# EAGLE design charLED (EAGLE 9.1.0)
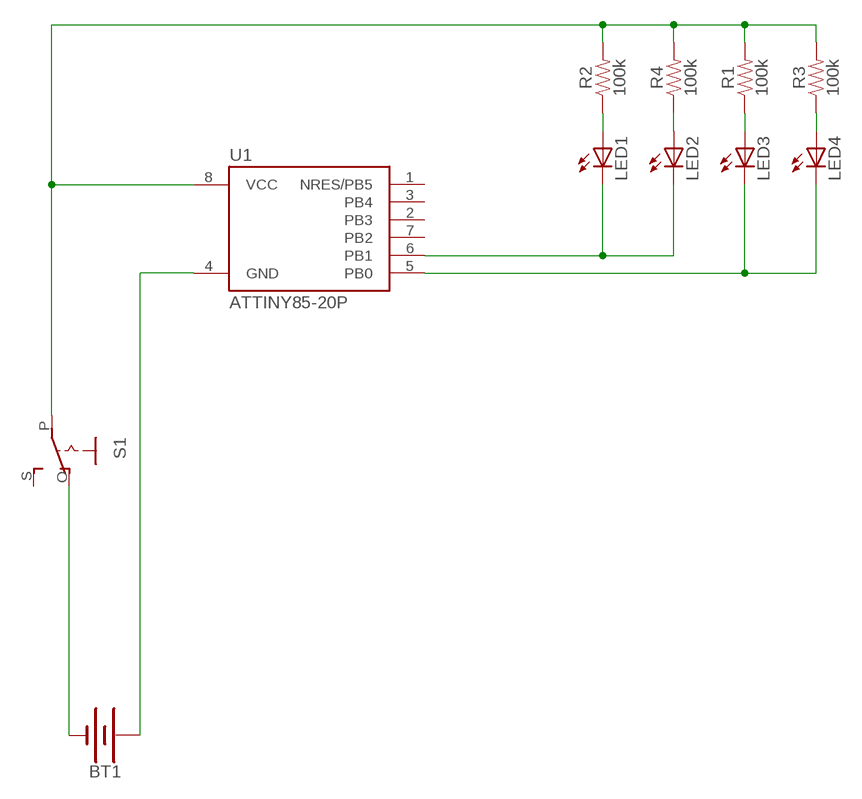
[diagram p0: schematic, sheet 1]

## Parts
BT1  BATTERY-20MM_PTH  [BATTCOM_20MM_PTH]
LED1  LED5MM  [LED5MM]
LED2  LED5MM  [LED5MM]
LED3  LED5MM  [LED5MM]
LED4  LED5MM  [LED5MM]
R1  100k  100KOHM-HORIZ-1/4W-1%  [AXIAL-0.3]
R2  100k  100KOHM-HORIZ-1/4W-1%  [AXIAL-0.3]
R3  100k  100KOHM-HORIZ-1/4W-1%  [AXIAL-0.3]
R4  100k  100KOHM-HORIZ-1/4W-1%  [AXIAL-0.3]
S1  EG1218S  [EG1218]
U1  ATTINY85-20P  [PDIP08_300MIL]

## Nets
N$1: LED1.K(C) LED2.K(C) U1.6(PB1)
N$2: LED1.A R2.P$1
N$3: BT1.2(-) S1.O
N$4: LED3.K(C) LED4.K(C) U1.5(PB0)
N$5: BT1.1(+) U1.4(GND)
N$6: R1.P$2 R2.P$2 R3.P$2 R4.P$2 S1.P U1.8(VCC)
N$7: LED2.A R4.P$1
N$8: LED4.A R3.P$1
N$9: LED3.A R1.P$1
Unconnected: S1.S U1.1(NRES/PB5) U1.2(PB3) U1.3(PB4) U1.7(PB2)

## Library data of the parts
BT1 = SparkFun-Batteries:BATTERY: Battery - Single Cell A variety of battery chemistries, sizes, and footprints. Device List: 20MM_PTH - Coin Cell Battery Holder - 20mm (PTH) <https://www.sparkfun.com/products/783> 6.8MM_PTH - Coin Cell Battery Holder - 6.8MM(SMD) <https://www.digikey.com/product-detail/en/seiko-instruments/MS621FE-FL11E/728-1057-ND/1889208?WT.srch=1&gclid=CNOQ5a6LzdQCFZS2wAodXCkE0g> 12MM_SMD - Coin Cell Battery Holder - 12mm (SMD) <https://www.sparkfun.com/products/10592> 12MM_PTH - Coin Cell Battery Holder - 12mm (PTH) <https://www.sparkfun.com/products/7948> 20MM_SMD - 20mm Coin Cell Battery Holder (SMD) (2 legs) Used on the Big Time Watch Kit <https://www.sparkfun.com/products/11734> 20MM_SMD_4LEGS - Coin Cell Battery Holder - 20mm (SMD) <https://www.sparkfun.com/products/11892> 20MM_SMD_4LEGS_OVERPASTE - Coin Cell Battery Holder - 20mm (SMD) <https://www.sparkfun.com/products/11892> (Over-paste on the legs) 24.5MM_PTH - Coin Cell Battery Holder - 24.5mm (PTH) <https://www.sparkfun.com/products/8863> 9V - 9V Battery Holder - PC Mount Used on the SparkFun SparkPunk Sound Kit <https://www.sparkfun.com/products/11177> and SparkFun SparkPunk Sequencer Kit <https://www.sparkfun.com/products/12707> 18650 - Battery Holder - 18650 (PTH) <https://www.sparkfun.com/products/13113> AA - Battery Holder - 1xAA (PTH) <https://www.sparkfun.com/products/7949> AAA - Battery Holder - 1xAAA (PTH) <https://www.sparkfun.com/products/12718> AA_KIT - Battery Holder - 1xAA (PTH) <https://www.sparkfun.com/products/7949> Special kit package - pads only have exposed copper on one side of the board. AAA_KIT - Battery Holder - 1xAAA (PTH) <https://www.sparkfun.com/products/12718> Special kit package - pads only have exposed copper on one side of the board.; PROD_ID: BATT-09031; SF_SKU: PRT-00783
LED1-LED4 = adafruit:LED: LED OSRAM: - CHIPLED LG R971, LG N971, LY N971, LG Q971, LY Q971, LO R971, LY R971 LH N974, LH R974 LS Q976, LO Q976, LY Q976 LO Q996 - Hyper CHIPLED LW Q18S LB Q993, LB Q99A, LB R99A - SideLED LS A670, LO A670, LY A670, LG A670, LP A670 LB A673, LV A673, LT A673, LW A673 LH A674 LY A675 LS A676, LA A676, LO A676, LY A676, LW A676 LS A679, LY A679, LG A679 - Hyper Micro SIDELED® LS Y876, LA Y876, LO Y876, LY Y876 LT Y87S - SmartLED LW L88C, LW L88S LB L89C, LB L89S, LG L890 LS L89K, LO L89K, LY L89K LS L896, LA L896, LO L896, LY L896 - TOPLED LS T670, LO T670, LY T670, LG T670, LP T670 LSG T670, LSP T670, LSY T670, LOP T670, LYG T670 LG T671, LOG T671, LSG T671 LB T673, LV T673, LT T673, LW T673 LH T674 LS T676, LA T676, LO T676, LY T676, LB T676, LH T676, LSB T676, LW T676 LB T67C, LV T67C, LT T67C, LS T67K, LO T67K, LY T67K, LW E67C LS E67B, LA E67B, LO E67B, LY E67B, LB E67C, LV E67C, LT E67C LW T67C LS T679, LY T679, LG T679 LS T770, LO T770, LY T770, LG T770, LP T770 LB T773, LV T773, LT T773, LW T773 LH T774 LS E675, LA E675, LY E675, LS T675 LS T776, LA T776, LO T776, LY T776, LB T776 LHGB T686 LT T68C, LB T68C - Hyper Mini TOPLED® LB M676 - Mini TOPLED Santana® LG M470 LS M47K, LO M47K, LY M47K Source: http://www.osram.convergy.de/
R1-R4 = SparkFun-Resistors:100KOHM: 100kΩ resistor A resistor is a passive two-terminal electrical component that implements electrical resistance as a circuit element. Resistors act to reduce current flow, and, at the same time, act to lower voltage levels within circuits. - Wikipedia; PROD_ID: RES-12184
S1 = adafruit:EG1218: SLIDING SWITCH 0.1" spacing through hole, vertical SPDT slide switch http://www.ladyada.net/library/pcb/eaglelibrary.html
U1 = _hhn_attiny25_45_85:ATTINY85*: ATMEL ATtiny 85 Packages: P = PDIP 08 30mil S = SOIC 08 EIAJ 208mil Technologies Note: for complete ordering code (temp. range, finish, tape&reel etc.) see www.atmel.com • Supply Voltage: V = (1.8…5.5)V | [blank] = (2.7…5.5)V • Speed: 10 = 10 MHz | 20 = 20 MHz Author: Dipl.-Ing. FH Rainer Bayer HHN Hochschule Heilbronn (Heilbronn University), rainer.bayer@hs-heilbronn.de Ingenieurbüro ing-rb, mail@ing-rb.de

## Board
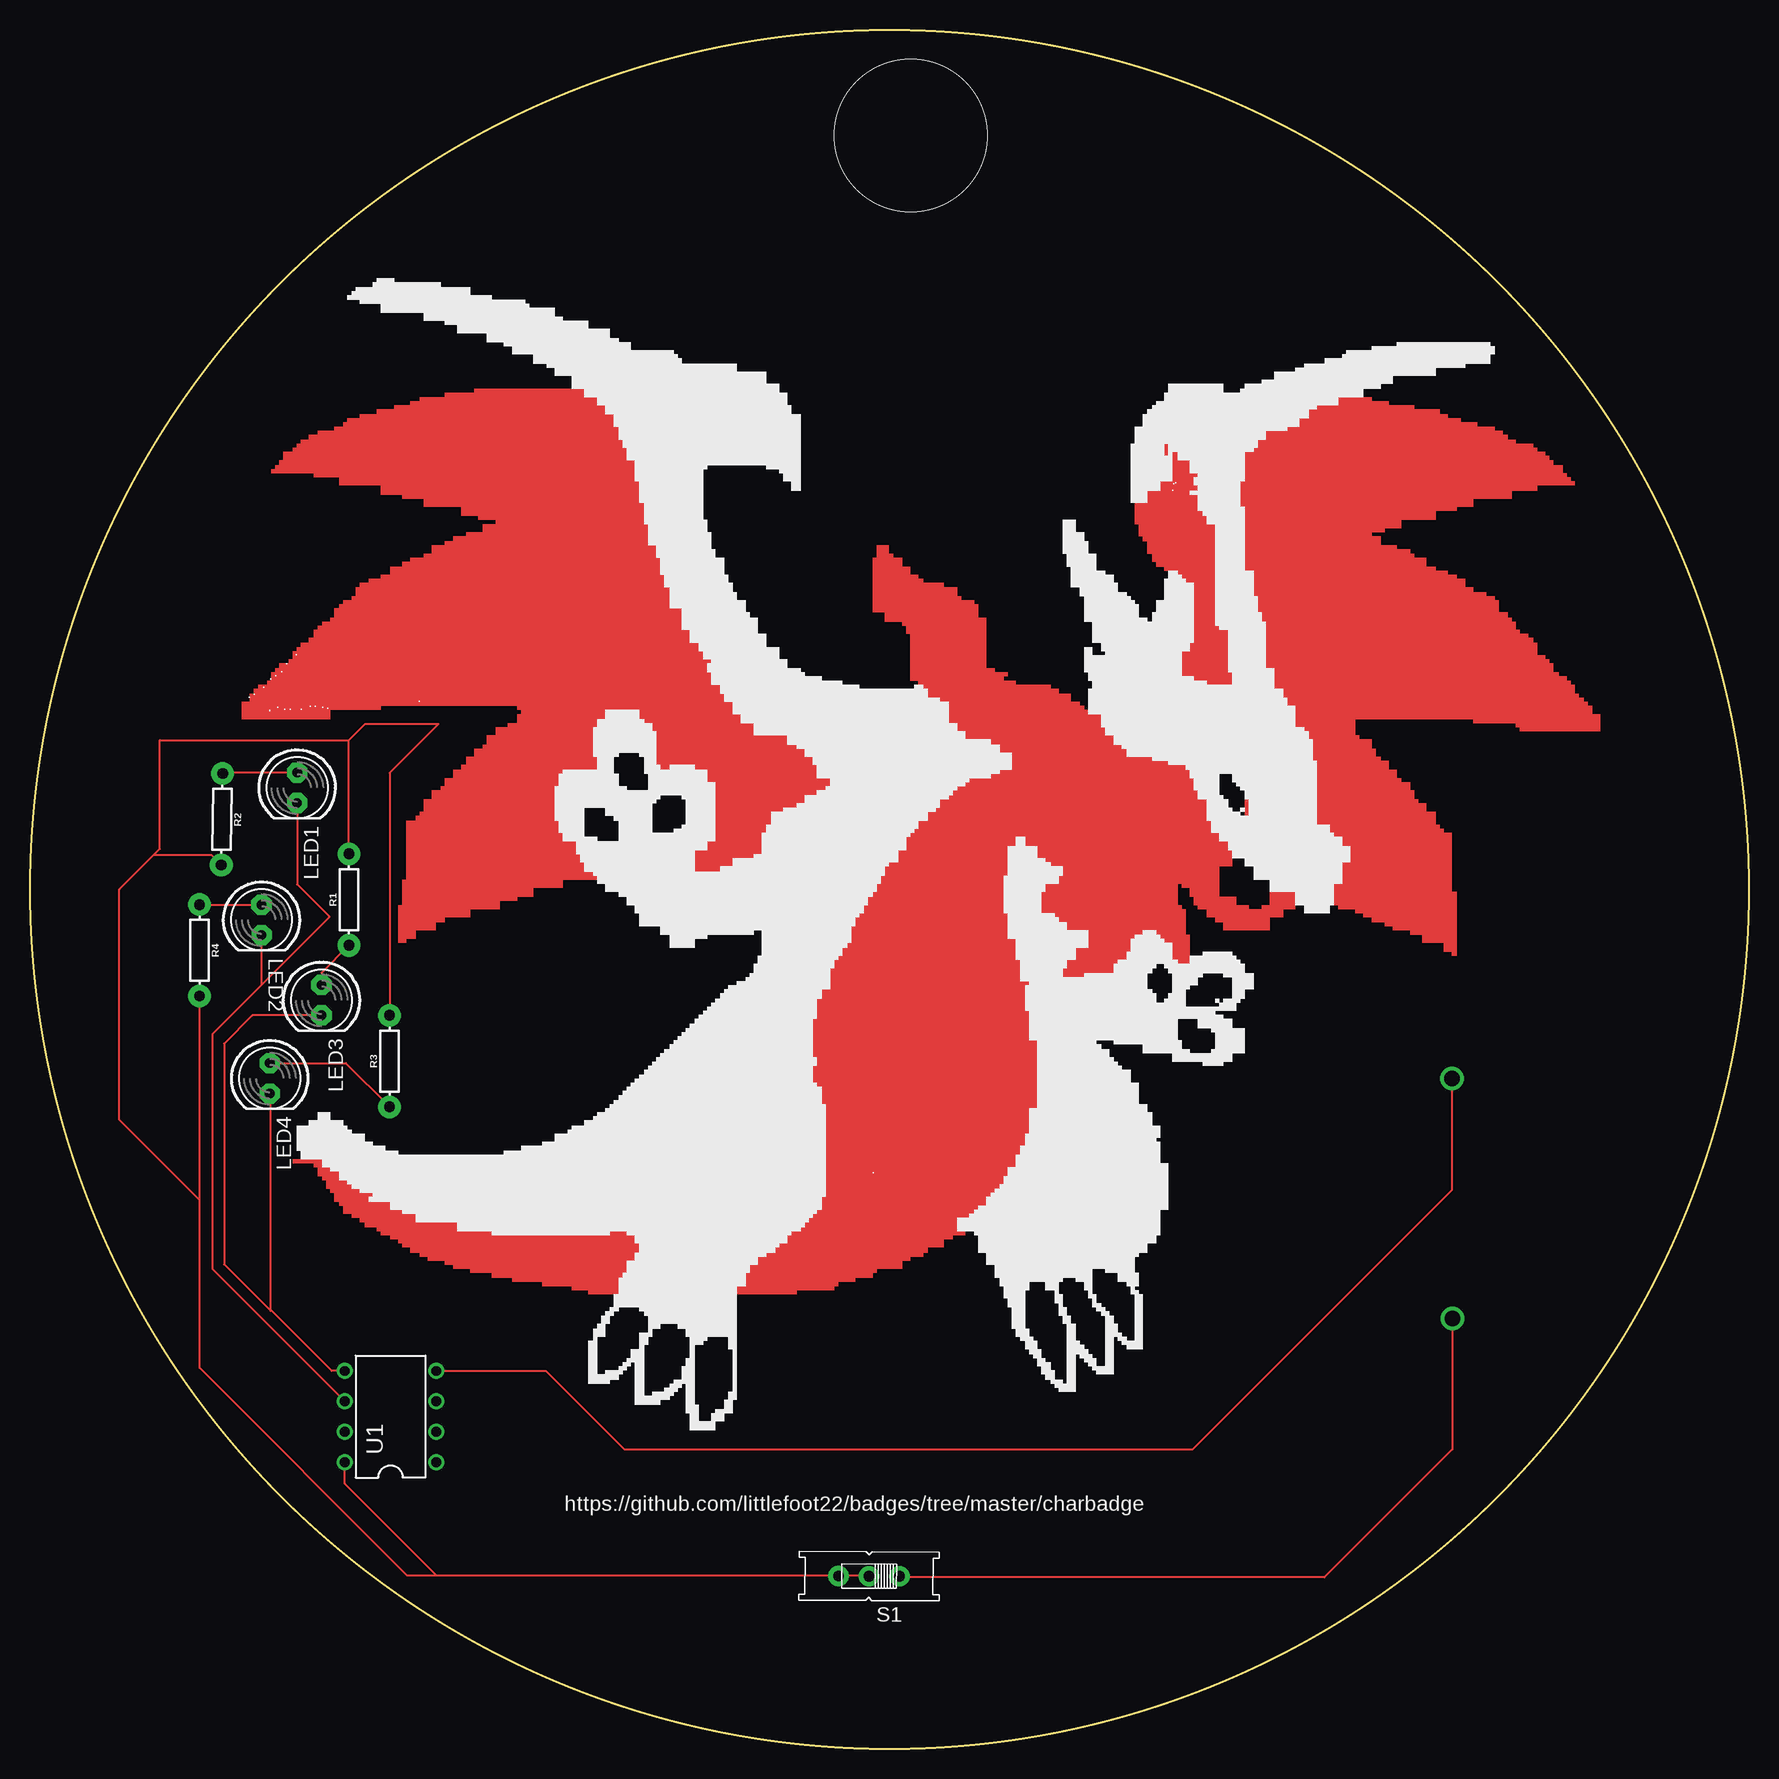
[diagram p1: board, top side]
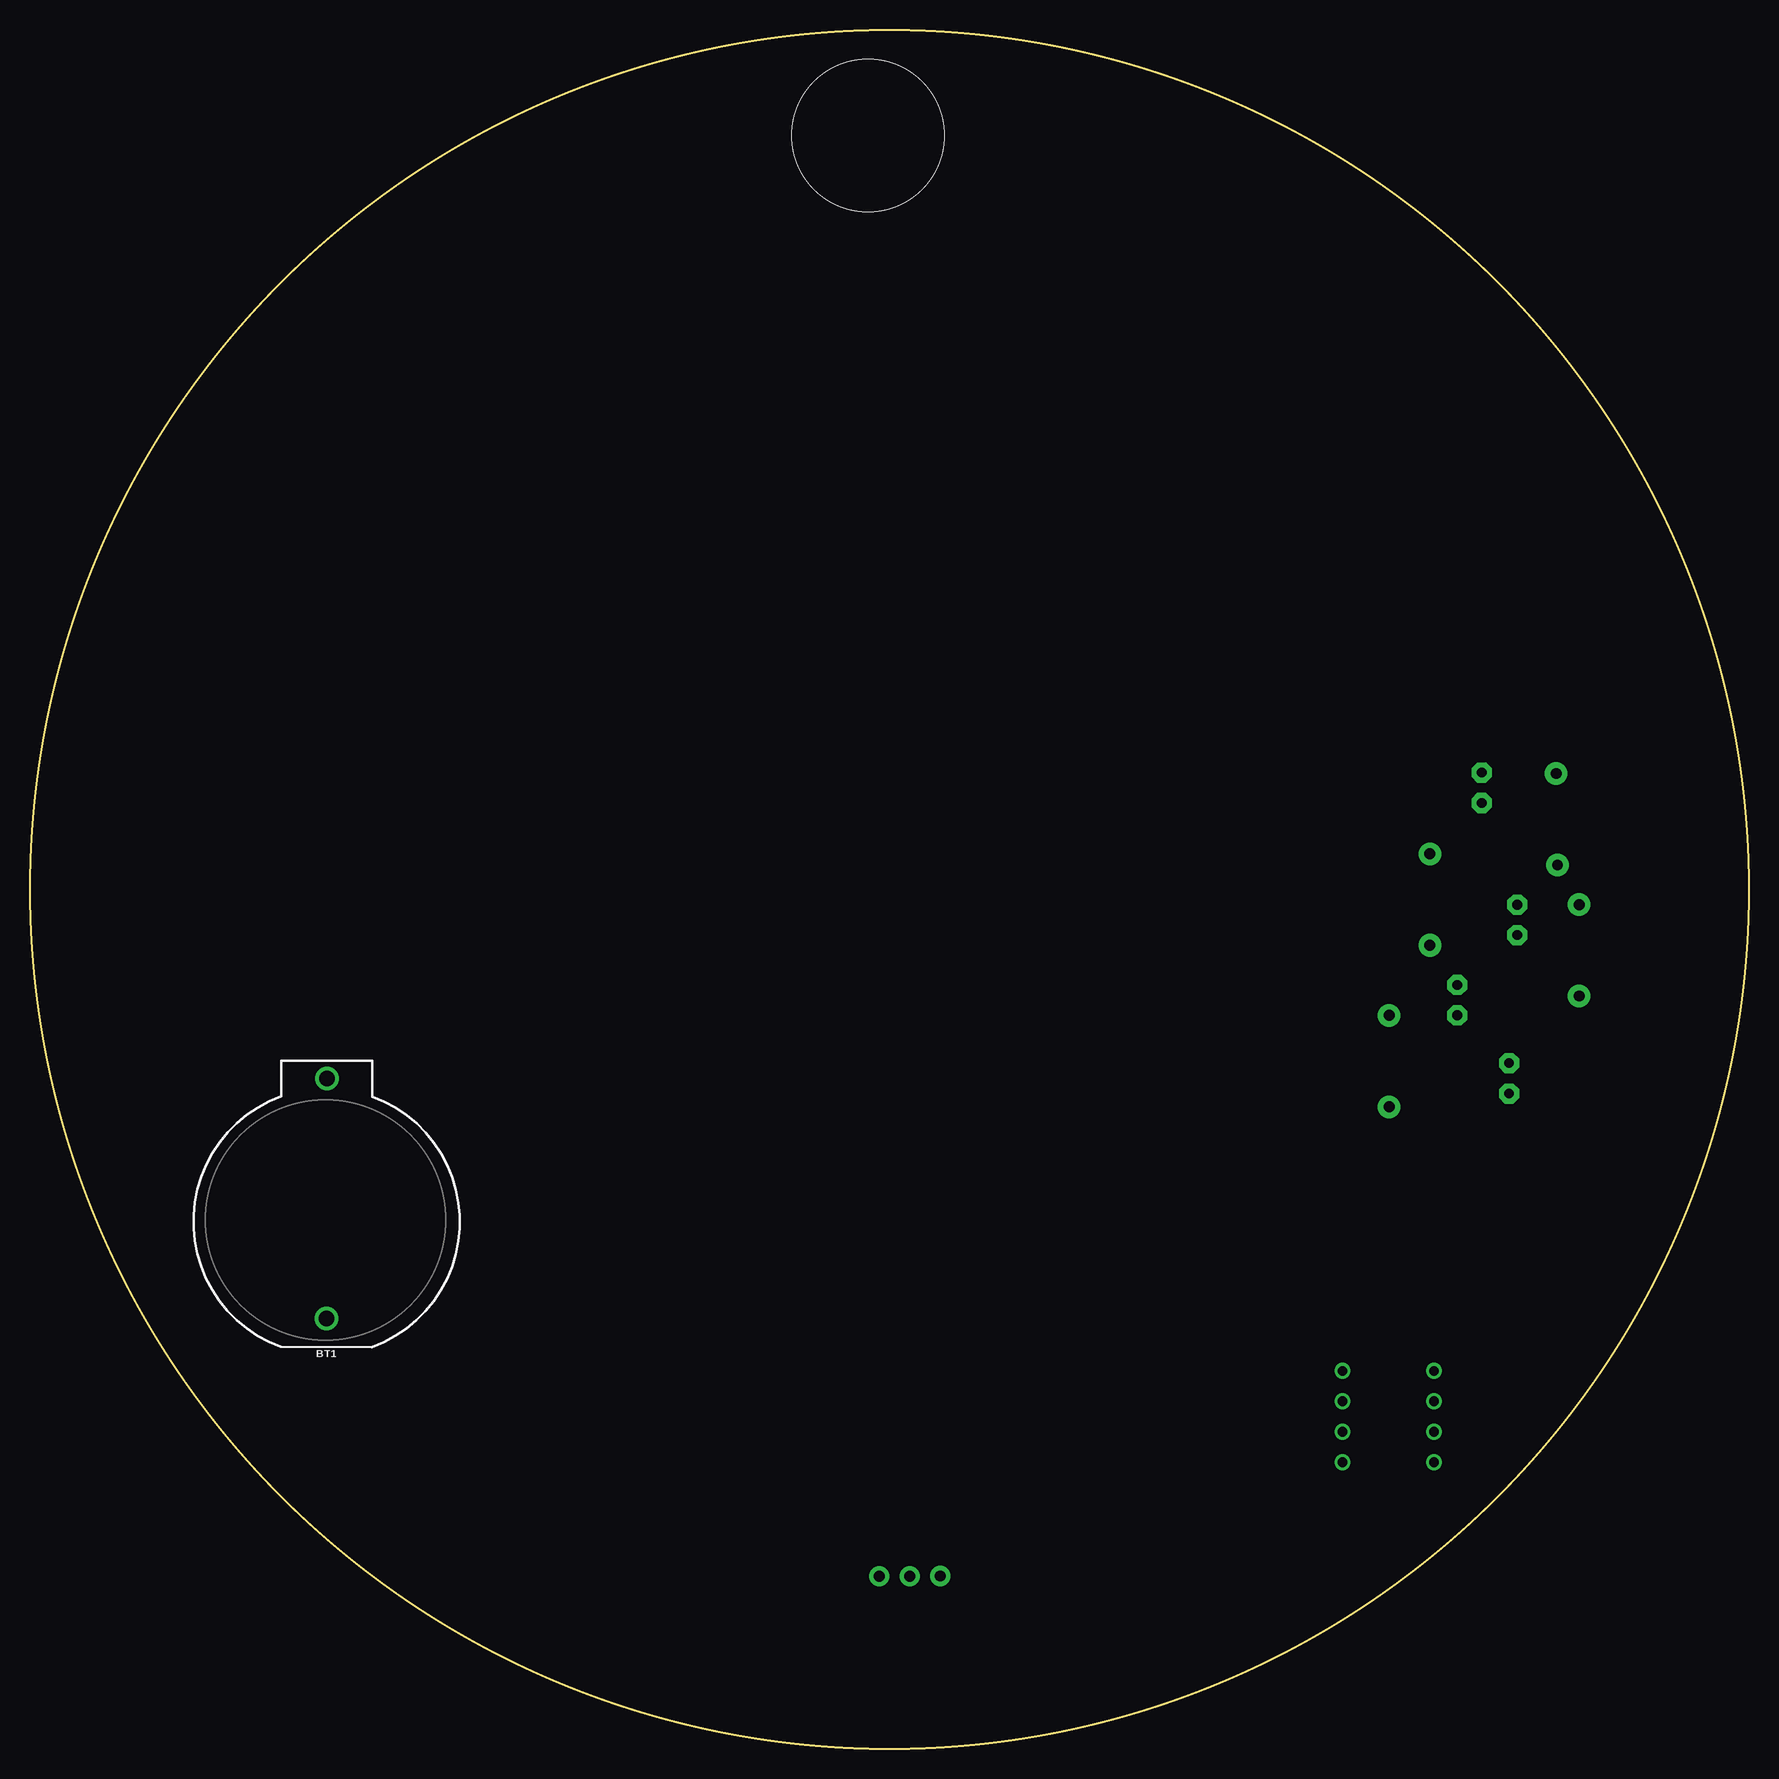
[diagram p2: board, bottom side, seen from below]

Size 143.23 x 143.23 mm. Coordinates in mm from the lower left corner, seen from the top.
Outline: circle at 71.62,71.62 radius 71.62
Copper layers (1*16): Top 0.035mm / dielectric 1.5mm / Bottom 0.035mm
Design rules "default": minimum track width 6mil, minimum drill 0.35mm, track to track 6mil, track to pad 6mil, pad to pad 6mil, via to via 6mil, smd to smd 6mil, copper to edge 40mil, drill to drill 6mil, minimum pad ring 10mil, minimum via ring 8mil, stop-mask expansion 4mil, vias tented up to drill 0mil, thermal gap 10mil
Holes 12.7 mm at 73.39,134.43

### Footprints (pad centres in the part's own frame; a part is rotated, then mirrored left to right if it is on the bottom)
BATTCOM_20MM_PTH = drill 1.3: 1 11.85,0; 2 -8.15,0
LED5MM = drill 0.813 pad 1.676 octagon: A -1.27,0; K 1.27,0
AXIAL-0.3 = drill 0.9 pad 1.88: P$1 -3.81,0; P$2 3.81,0
EG1218 = drill 0.9 pad 1.676: O -2.54,0; P 0,0; S 2.54,0
PDIP08_300MIL = drill 0.813: 1 -3.81,-3.81; 2 -1.27,-3.81; 3 1.27,-3.81; 4 3.81,-3.81; 5 3.81,3.81; 6 1.27,3.81; 7 -1.27,3.81; 8 -3.81,3.81

### Placement (x,y rotation side)
BT1  118.51,44.02 89.9 bottom
LED1  22.26,80.08 269.9 top
LED2  19.3,69.08 270.2 top
LED3  24.29,62.39 270 top
LED4  19.97,55.87 270 top
R1  26.58,70.77 90 top
R2  16,77.46 269.1 top
R3  29.96,57.31 90 top
R4  14.13,66.54 270 top
S1  69.92,14.39 179.7 top
U1  30.05,27.68 90 top

### Tracks (layer width: path | path; a pad name or v marks a point on that pad's centre or on a via)
N$1
  Top 0.152: U1.6 15.23,39.95 15.23,59.59 19.25,63.62 | 19.25,63.62 19.3,63.66 LED2.K | 19.25,63.62 | 19.25,63.62 24.93,69.29 24.93,69.37 22.26,72.04 LED1.K
N$2
  Top 0.152: LED1.A 16.14,81.35 R2.P$1
N$3
  Top 0.152: S1.O 73.25,14.28 107.86,14.28 118.53,24.95 BT1.2
N$4
  Top 0.152: 20.06,37.67 20.06,54.51 LED4.K | LED3.K 18.53,61.12 16.18,58.77 16.18,40.36 20.06,36.48 20.06,37.67 | 25.73,31.49 U1.5 25.14,31.49 20.06,36.57 20.06,37.67
N$5
  Top 0.152: U1.4 43,31.49 49.52,24.97 96.91,24.97 118.49,46.56 BT1.1
N$6
  Top 0.152: 35.8,14.43 69.88,14.43 S1.P | 35.8,14.43 35.68,14.43 | 14.13,45.71 14.13,51.81 14.13,53.75 | 14.13,53.75 R4.P$2 | 14.13,53.75 | 14.13,45.71 7.44,52.4 7.44,71.62 10.32,74.49 | 10.32,74.49 15.09,74.49 R2.P$2 | 26.58,84.06 10.83,84.06 10.83,75 10.32,74.49 | R3.P$2 29.96,81.33 34.05,85.42 27.93,85.42 26.58,84.06 | 33.86,14.43 33.9,14.43 26.24,22.09 U1.8 | 33.86,14.43 32.42,14.43 31.45,14.43 14.13,31.74 14.13,45.71 | 35.8,14.43 33.86,14.43 | R1.P$2 26.58,84.06
N$7
  Top 0.152: R4.P$1 LED2.A
N$8
  Top 0.152: LED4.A 26.32,57.14 R3.P$1
N$9
  Top 0.152: LED3.A 24.29,64.67 R1.P$1
(copper drawn outside any net)
  shapes: Top area x2667

### Text on the board
tPlace: https://github.com/littlefoot22/badges/tree/master/charbadge